# Altium schematic sheet E-06 CPU IO_PHY.SchDoc: FRDM-IMX93
size 513 x 386 mm; DrawnBy: FORLINX; Organization: ORGANIZATION; Address1: ADDRESS 1; Address2: ADDRESS 2; Address3: ADDRESS 3; Address4: ADDRESS 4; Revision: -; ENG_APP_DATE: --/--/--; DSN_APP_DATE: --/--/--; CHK_APP_DATE: --/--/--; Classification: Public, Company Internal/Proprietary, Company Confidential,  Company Secret; Page Create Date: March  8, 1995; OrgName: NXP Semiconductor; FIUO: A; OrgAddr1: NO. 192 Liangjing Rd. Pudong New Area, ShangHai; Page Number: 6; PageTitle: CPU IO/PHY; Page Size: C; Page Count: 23; Designer: FORLINX; RevCode: B1; Approver: NXP SE; Doc: SCH-94611 PDF: SPF-94611; DsnPath: T:\FILES\Designs\Single Board Computers\i.MX93-FRDM\Design Files\SCH-94611_B1.DSN; SchematicName: FRDM-i.MX 93 Development Board; PageName: E-06 CPU IO/PHY; PageSize: C; TopSchematic: True
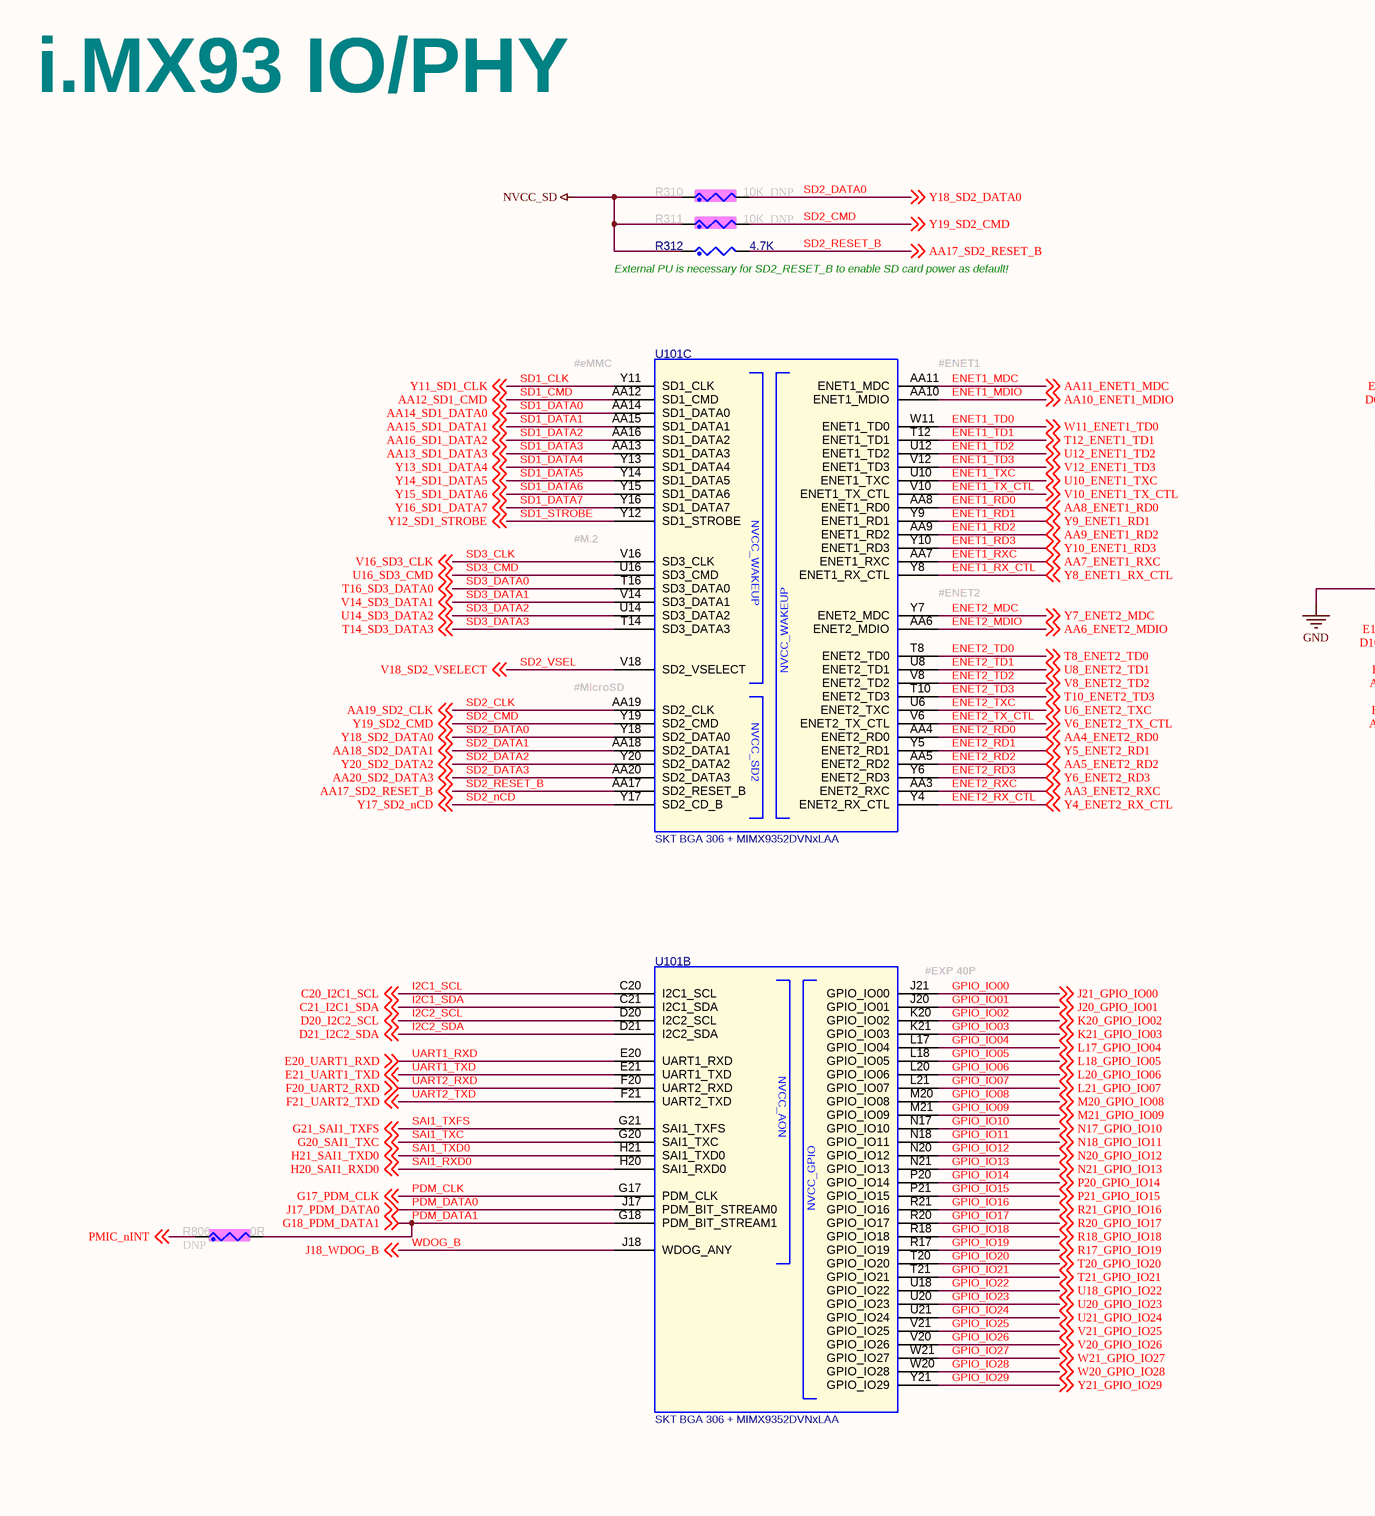
[diagram p0: E-06 CPU IO_PHY.SchDoc, left]
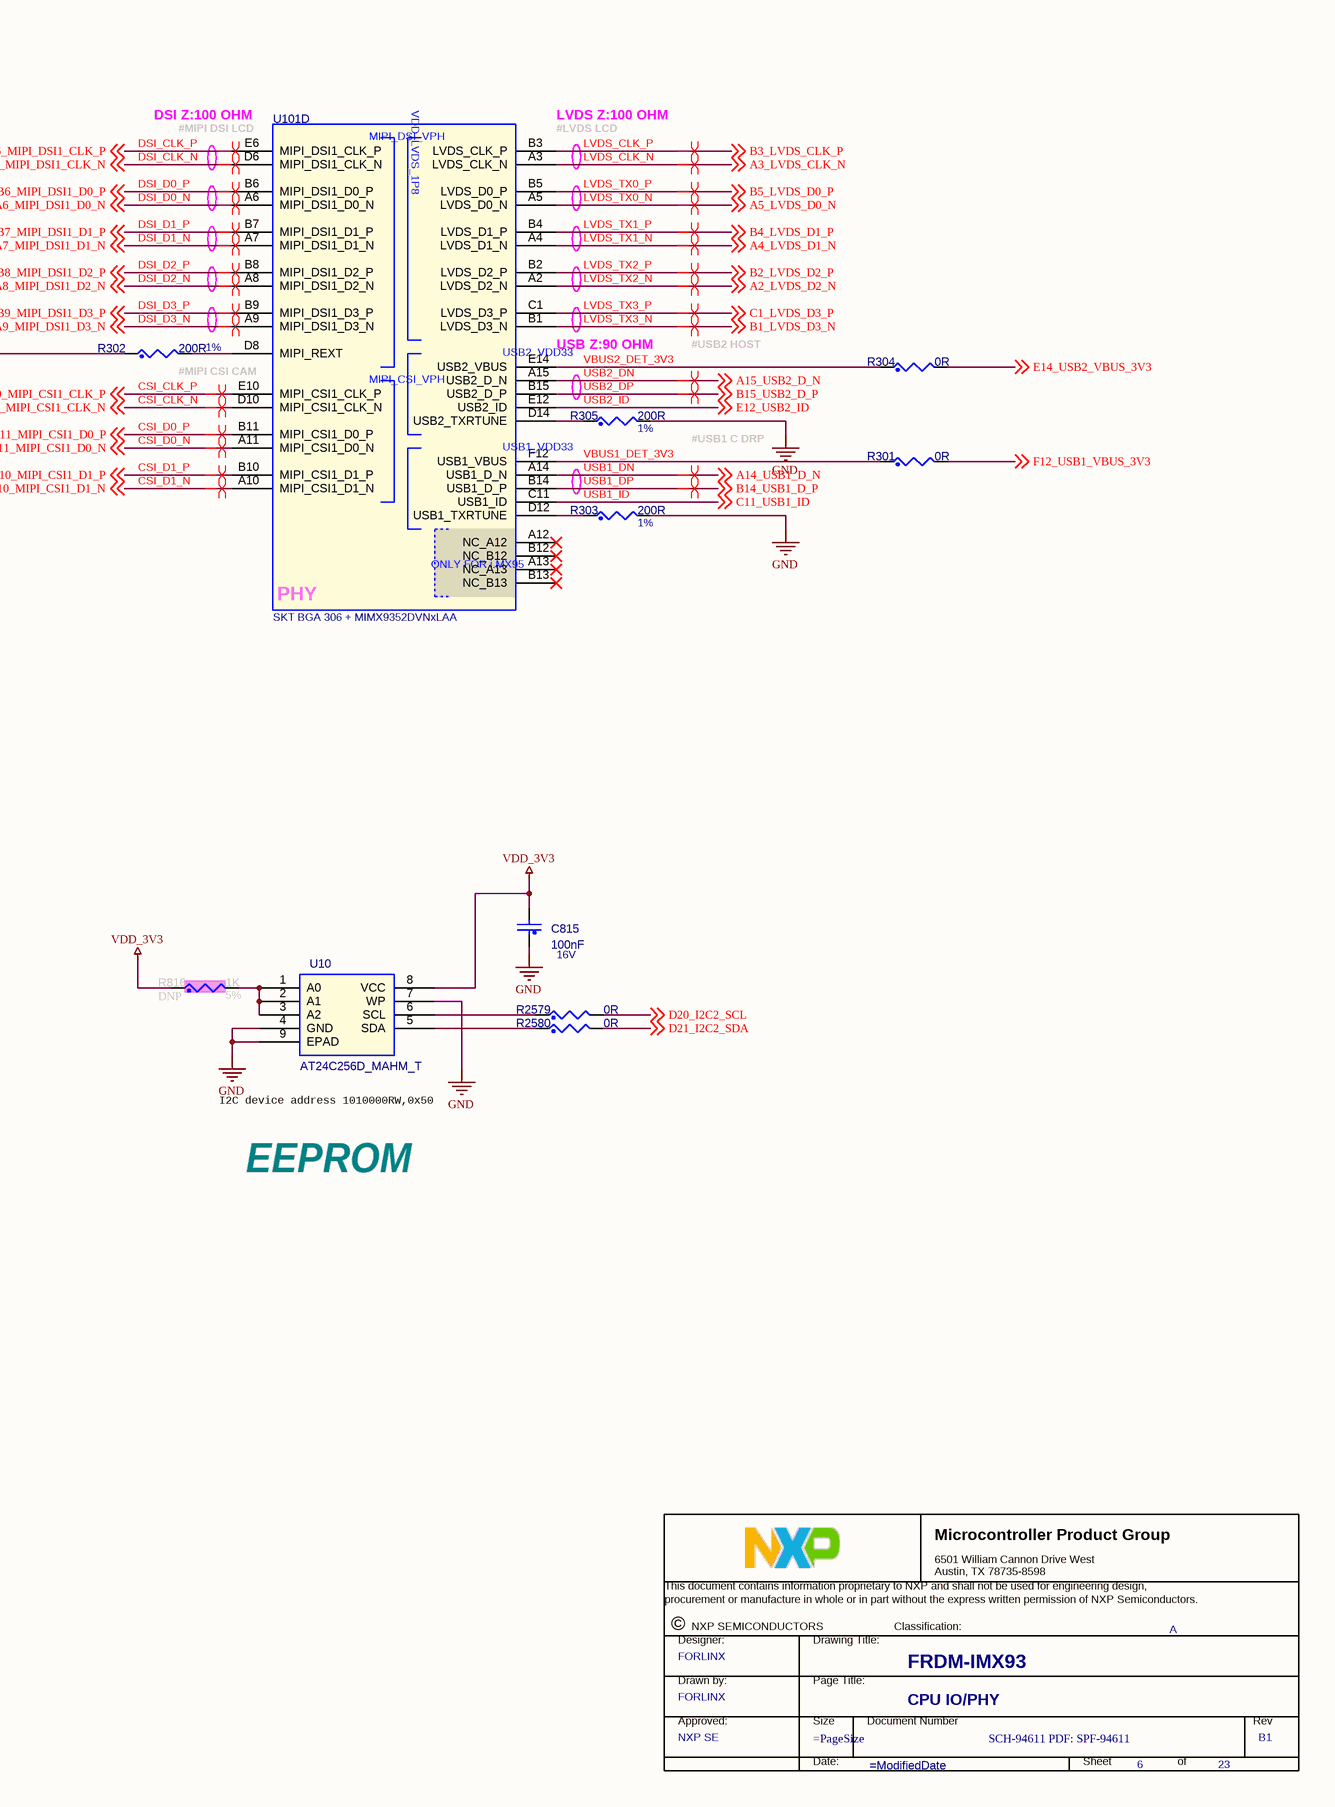
[diagram p1: E-06 CPU IO_PHY.SchDoc, right]

## Parts
*  Title: FRDM-IMX93  RevCode: B1  PageTitle: CPU IO/PHY  Page Number: 6  Page Count: 23  DrawnBy: FORLINX  Doc: SCH-94611 PDF: SPF-94611  Approver: NXP SE  FIUO: A  (graphical)
C815  100nF  VOLTAGE: 16V  [C0402]
R301  0R  [R0201]
R302  200R  Tolerance: 1%  [R0201]
R303  200R  Tolerance: 1%  [R0201]
R304  0R  [R0201]
R305  200R  Tolerance: 1%  [R0201]
R310  10K  ASSY_OPT: DNP  [R0402]
R311  10K  ASSY_OPT: DNP  [R0402]
R312  4.7K  [R0402]
R806  0R  ASSY_OPT: DNP  [R0201]
R816  1K  ASSY_OPT: DNP  Tolerance: 5%  [R0402]
R2579  0R  [R0402]
R2580  0R  [R0402]
U10  AT24C256D_MAHM_T  [UDFN-8P]
U101  SKT BGA 306 + MIMX9352DVNxLAA  [skt_bga306_0p5_sq16p23_elast_nsp]  (parts B,C,D of 6)

## Nets
GND: C815.1 R302.1 R303.2 R305.2 U10.4(GND) U10.7(WP) U10.9(EPAD)
NVCC_SD: R310.1 R311.1 R312.1
VDD_3V3: C815.2 R816.1 U10.8(VCC)
CSI_CLK_N: U101.D10(MIPI_CSI1_CLK_N) ; off-sheet D10_MIPI_CSI1_CLK_N  [also labelled D10_MIPI_CSI1_CLK_N]
CSI_CLK_P: U101.E10(MIPI_CSI1_CLK_P) ; off-sheet E10_MIPI_CSI1_CLK_P  [also labelled E10_MIPI_CSI1_CLK_P]
CSI_D0_N: U101.A11(MIPI_CSI1_D0_N) ; off-sheet A11_MIPI_CSI1_D0_N  [also labelled A11_MIPI_CSI1_D0_N]
CSI_D0_P: U101.B11(MIPI_CSI1_D0_P) ; off-sheet B11_MIPI_CSI1_D0_P  [also labelled B11_MIPI_CSI1_D0_P]
CSI_D1_N: U101.A10(MIPI_CSI1_D1_N) ; off-sheet A10_MIPI_CSI1_D1_N  [also labelled A10_MIPI_CSI1_D1_N]
CSI_D1_P: U101.B10(MIPI_CSI1_D1_P) ; off-sheet B10_MIPI_CSI1_D1_P  [also labelled B10_MIPI_CSI1_D1_P]
DSI_CLK_N: U101.D6(MIPI_DSI1_CLK_N) ; off-sheet D6_MIPI_DSI1_CLK_N  [also labelled D6_MIPI_DSI1_CLK_N]
DSI_CLK_P: U101.E6(MIPI_DSI1_CLK_P) ; off-sheet E6_MIPI_DSI1_CLK_P  [also labelled E6_MIPI_DSI1_CLK_P]
DSI_D0_N: U101.A6(MIPI_DSI1_D0_N) ; off-sheet A6_MIPI_DSI1_D0_N  [also labelled A6_MIPI_DSI1_D0_N]
DSI_D0_P: U101.B6(MIPI_DSI1_D0_P) ; off-sheet B6_MIPI_DSI1_D0_P  [also labelled B6_MIPI_DSI1_D0_P]
DSI_D1_N: U101.A7(MIPI_DSI1_D1_N) ; off-sheet A7_MIPI_DSI1_D1_N  [also labelled A7_MIPI_DSI1_D1_N]
DSI_D1_P: U101.B7(MIPI_DSI1_D1_P) ; off-sheet B7_MIPI_DSI1_D1_P  [also labelled B7_MIPI_DSI1_D1_P]
DSI_D2_N: U101.A8(MIPI_DSI1_D2_N) ; off-sheet A8_MIPI_DSI1_D2_N  [also labelled A8_MIPI_DSI1_D2_N]
DSI_D2_P: U101.B8(MIPI_DSI1_D2_P) ; off-sheet B8_MIPI_DSI1_D2_P  [also labelled B8_MIPI_DSI1_D2_P]
DSI_D3_N: U101.A9(MIPI_DSI1_D3_N) ; off-sheet A9_MIPI_DSI1_D3_N  [also labelled A9_MIPI_DSI1_D3_N]
DSI_D3_P: U101.B9(MIPI_DSI1_D3_P) ; off-sheet B9_MIPI_DSI1_D3_P  [also labelled B9_MIPI_DSI1_D3_P]
E14_USB2_VBUS_3V3: R304.2 ; off-sheet E14_USB2_VBUS_3V3
ENET1_MDC: U101.AA11(ENET1_MDC) ; off-sheet AA11_ENET1_MDC  [also labelled AA11_ENET1_MDC]
ENET1_MDIO: U101.AA10(ENET1_MDIO) ; off-sheet AA10_ENET1_MDIO  [also labelled AA10_ENET1_MDIO]
ENET1_RD0: U101.AA8(ENET1_RD0) ; off-sheet AA8_ENET1_RD0  [also labelled AA8_ENET1_RD0]
ENET1_RD1: U101.Y9(ENET1_RD1) ; off-sheet Y9_ENET1_RD1  [also labelled Y9_ENET1_RD1]
ENET1_RD2: U101.AA9(ENET1_RD2) ; off-sheet AA9_ENET1_RD2  [also labelled AA9_ENET1_RD2]
ENET1_RD3: U101.Y10(ENET1_RD3) ; off-sheet Y10_ENET1_RD3  [also labelled Y10_ENET1_RD3]
ENET1_RX_CTL: U101.Y8(ENET1_RX_CTL) ; off-sheet Y8_ENET1_RX_CTL  [also labelled Y8_ENET1_RX_CTL]
ENET1_RXC: U101.AA7(ENET1_RXC) ; off-sheet AA7_ENET1_RXC  [also labelled AA7_ENET1_RXC]
ENET1_TD0: U101.W11(ENET1_TD0) ; off-sheet W11_ENET1_TD0  [also labelled W11_ENET1_TD0]
ENET1_TD1: U101.T12(ENET1_TD1) ; off-sheet T12_ENET1_TD1  [also labelled T12_ENET1_TD1]
ENET1_TD2: U101.U12(ENET1_TD2) ; off-sheet U12_ENET1_TD2  [also labelled U12_ENET1_TD2]
ENET1_TD3: U101.V12(ENET1_TD3) ; off-sheet V12_ENET1_TD3  [also labelled V12_ENET1_TD3]
ENET1_TX_CTL: U101.V10(ENET1_TX_CTL) ; off-sheet V10_ENET1_TX_CTL  [also labelled V10_ENET1_TX_CTL]
ENET1_TXC: U101.U10(ENET1_TXC) ; off-sheet U10_ENET1_TXC  [also labelled U10_ENET1_TXC]
ENET2_MDC: U101.Y7(ENET2_MDC) ; off-sheet Y7_ENET2_MDC  [also labelled Y7_ENET2_MDC]
ENET2_MDIO: U101.AA6(ENET2_MDIO) ; off-sheet AA6_ENET2_MDIO  [also labelled AA6_ENET2_MDIO]
ENET2_RD0: U101.AA4(ENET2_RD0) ; off-sheet AA4_ENET2_RD0  [also labelled AA4_ENET2_RD0]
ENET2_RD1: U101.Y5(ENET2_RD1) ; off-sheet Y5_ENET2_RD1  [also labelled Y5_ENET2_RD1]
ENET2_RD2: U101.AA5(ENET2_RD2) ; off-sheet AA5_ENET2_RD2  [also labelled AA5_ENET2_RD2]
ENET2_RD3: U101.Y6(ENET2_RD3) ; off-sheet Y6_ENET2_RD3  [also labelled Y6_ENET2_RD3]
ENET2_RX_CTL: U101.Y4(ENET2_RX_CTL) ; off-sheet Y4_ENET2_RX_CTL  [also labelled Y4_ENET2_RX_CTL]
ENET2_RXC: U101.AA3(ENET2_RXC) ; off-sheet AA3_ENET2_RXC  [also labelled AA3_ENET2_RXC]
ENET2_TD0: U101.T8(ENET2_TD0) ; off-sheet T8_ENET2_TD0  [also labelled T8_ENET2_TD0]
ENET2_TD1: U101.U8(ENET2_TD1) ; off-sheet U8_ENET2_TD1  [also labelled U8_ENET2_TD1]
ENET2_TD2: U101.V8(ENET2_TD2) ; off-sheet V8_ENET2_TD2  [also labelled V8_ENET2_TD2]
ENET2_TD3: U101.T10(ENET2_TD3) ; off-sheet T10_ENET2_TD3  [also labelled T10_ENET2_TD3]
ENET2_TX_CTL: U101.V6(ENET2_TX_CTL) ; off-sheet V6_ENET2_TX_CTL  [also labelled V6_ENET2_TX_CTL]
ENET2_TXC: U101.U6(ENET2_TXC) ; off-sheet U6_ENET2_TXC  [also labelled U6_ENET2_TXC]
F12_USB1_VBUS_3V3: R301.2 ; off-sheet F12_USB1_VBUS_3V3
GPIO_IO00: U101.J21(GPIO_IO00) ; off-sheet J21_GPIO_IO00  [also labelled J21_GPIO_IO00]
GPIO_IO01: U101.J20(GPIO_IO01) ; off-sheet J20_GPIO_IO01  [also labelled J20_GPIO_IO01]
GPIO_IO02: U101.K20(GPIO_IO02) ; off-sheet K20_GPIO_IO02  [also labelled K20_GPIO_IO02]
GPIO_IO03: U101.K21(GPIO_IO03) ; off-sheet K21_GPIO_IO03  [also labelled K21_GPIO_IO03]
GPIO_IO04: U101.L17(GPIO_IO04) ; off-sheet L17_GPIO_IO04  [also labelled L17_GPIO_IO04]
GPIO_IO05: U101.L18(GPIO_IO05) ; off-sheet L18_GPIO_IO05  [also labelled L18_GPIO_IO05]
GPIO_IO06: U101.L20(GPIO_IO06) ; off-sheet L20_GPIO_IO06  [also labelled L20_GPIO_IO06]
GPIO_IO07: U101.L21(GPIO_IO07) ; off-sheet L21_GPIO_IO07  [also labelled L21_GPIO_IO07]
GPIO_IO08: U101.M20(GPIO_IO08) ; off-sheet M20_GPIO_IO08  [also labelled M20_GPIO_IO08]
GPIO_IO09: U101.M21(GPIO_IO09) ; off-sheet M21_GPIO_IO09  [also labelled M21_GPIO_IO09]
GPIO_IO10: U101.N17(GPIO_IO10) ; off-sheet N17_GPIO_IO10  [also labelled N17_GPIO_IO10]
GPIO_IO11: U101.N18(GPIO_IO11) ; off-sheet N18_GPIO_IO11  [also labelled N18_GPIO_IO11]
GPIO_IO12: U101.N20(GPIO_IO12) ; off-sheet N20_GPIO_IO12  [also labelled N20_GPIO_IO12]
GPIO_IO13: U101.N21(GPIO_IO13) ; off-sheet N21_GPIO_IO13  [also labelled N21_GPIO_IO13]
GPIO_IO14: U101.P20(GPIO_IO14) ; off-sheet P20_GPIO_IO14  [also labelled P20_GPIO_IO14]
GPIO_IO15: U101.P21(GPIO_IO15) ; off-sheet P21_GPIO_IO15  [also labelled P21_GPIO_IO15]
GPIO_IO16: U101.R21(GPIO_IO16) ; off-sheet R21_GPIO_IO16  [also labelled R21_GPIO_IO16]
GPIO_IO17: U101.R20(GPIO_IO17) ; off-sheet R20_GPIO_IO17  [also labelled R20_GPIO_IO17]
GPIO_IO18: U101.R18(GPIO_IO18) ; off-sheet R18_GPIO_IO18  [also labelled R18_GPIO_IO18]
GPIO_IO19: U101.R17(GPIO_IO19) ; off-sheet R17_GPIO_IO19  [also labelled R17_GPIO_IO19]
GPIO_IO20: U101.T20(GPIO_IO20) ; off-sheet T20_GPIO_IO20  [also labelled T20_GPIO_IO20]
GPIO_IO21: U101.T21(GPIO_IO21) ; off-sheet T21_GPIO_IO21  [also labelled T21_GPIO_IO21]
GPIO_IO22: U101.U18(GPIO_IO22) ; off-sheet U18_GPIO_IO22  [also labelled U18_GPIO_IO22]
GPIO_IO23: U101.U20(GPIO_IO23) ; off-sheet U20_GPIO_IO23  [also labelled U20_GPIO_IO23]
GPIO_IO24: U101.U21(GPIO_IO24) ; off-sheet U21_GPIO_IO24  [also labelled U21_GPIO_IO24]
GPIO_IO25: U101.V21(GPIO_IO25) ; off-sheet V21_GPIO_IO25  [also labelled V21_GPIO_IO25]
GPIO_IO26: U101.V20(GPIO_IO26) ; off-sheet V20_GPIO_IO26  [also labelled V20_GPIO_IO26]
GPIO_IO27: U101.W21(GPIO_IO27) ; off-sheet W21_GPIO_IO27  [also labelled W21_GPIO_IO27]
GPIO_IO28: U101.W20(GPIO_IO28) ; off-sheet W20_GPIO_IO28  [also labelled W20_GPIO_IO28]
GPIO_IO29: U101.Y21(GPIO_IO29) ; off-sheet Y21_GPIO_IO29  [also labelled Y21_GPIO_IO29]
I2C1_SCL: U101.C20(I2C1_SCL) ; off-sheet C20_I2C1_SCL  [also labelled C20_I2C1_SCL]
I2C1_SDA: U101.C21(I2C1_SDA) ; off-sheet C21_I2C1_SDA  [also labelled C21_I2C1_SDA]
I2C2_SCL: R2579.2 U101.D20(I2C2_SCL) ; off-sheet D20_I2C2_SCL  [also labelled D20_I2C2_SCL]
I2C2_SDA: R2580.2 U101.D21(I2C2_SDA) ; off-sheet D21_I2C2_SDA  [also labelled D21_I2C2_SDA]
LVDS_CLK_N: U101.A3(LVDS_CLK_N) ; off-sheet A3_LVDS_CLK_N  [also labelled A3_LVDS_CLK_N]
LVDS_CLK_P: U101.B3(LVDS_CLK_P) ; off-sheet B3_LVDS_CLK_P  [also labelled B3_LVDS_CLK_P]
LVDS_TX0_N: U101.A5(LVDS_D0_N) ; off-sheet A5_LVDS_D0_N  [also labelled A5_LVDS_D0_N]
LVDS_TX0_P: U101.B5(LVDS_D0_P) ; off-sheet B5_LVDS_D0_P  [also labelled B5_LVDS_D0_P]
LVDS_TX1_N: U101.A4(LVDS_D1_N) ; off-sheet A4_LVDS_D1_N  [also labelled A4_LVDS_D1_N]
LVDS_TX1_P: U101.B4(LVDS_D1_P) ; off-sheet B4_LVDS_D1_P  [also labelled B4_LVDS_D1_P]
LVDS_TX2_N: U101.A2(LVDS_D2_N) ; off-sheet A2_LVDS_D2_N  [also labelled A2_LVDS_D2_N]
LVDS_TX2_P: U101.B2(LVDS_D2_P) ; off-sheet B2_LVDS_D2_P  [also labelled B2_LVDS_D2_P]
LVDS_TX3_N: U101.B1(LVDS_D3_N) ; off-sheet B1_LVDS_D3_N  [also labelled B1_LVDS_D3_N]
LVDS_TX3_P: U101.C1(LVDS_D3_P) ; off-sheet C1_LVDS_D3_P  [also labelled C1_LVDS_D3_P]
PDM_CLK: U101.G17(PDM_CLK) ; off-sheet G17_PDM_CLK  [also labelled G17_PDM_CLK]
PDM_DATA0: U101.J17(PDM_BIT_STREAM0) ; off-sheet J17_PDM_DATA0  [also labelled J17_PDM_DATA0]
PDM_DATA1: R806.2 U101.G18(PDM_BIT_STREAM1) ; off-sheet G18_PDM_DATA1  [also labelled G18_PDM_DATA1]
PMIC_nINT: R806.1 ; off-sheet PMIC_nINT
SAI1_RXD0: U101.H20(SAI1_RXD0) ; off-sheet H20_SAI1_RXD0  [also labelled H20_SAI1_RXD0]
SAI1_TXC: U101.G20(SAI1_TXC) ; off-sheet G20_SAI1_TXC  [also labelled G20_SAI1_TXC]
SAI1_TXD0: U101.H21(SAI1_TXD0) ; off-sheet H21_SAI1_TXD0  [also labelled H21_SAI1_TXD0]
SAI1_TXFS: U101.G21(SAI1_TXFS) ; off-sheet G21_SAI1_TXFS  [also labelled G21_SAI1_TXFS]
SD1_CLK: U101.Y11(SD1_CLK) ; off-sheet Y11_SD1_CLK  [also labelled Y11_SD1_CLK]
SD1_CMD: U101.AA12(SD1_CMD) ; off-sheet AA12_SD1_CMD  [also labelled AA12_SD1_CMD]
SD1_DATA0: U101.AA14(SD1_DATA0) ; off-sheet AA14_SD1_DATA0  [also labelled AA14_SD1_DATA0]
SD1_DATA1: U101.AA15(SD1_DATA1) ; off-sheet AA15_SD1_DATA1  [also labelled AA15_SD1_DATA1]
SD1_DATA2: U101.AA16(SD1_DATA2) ; off-sheet AA16_SD1_DATA2  [also labelled AA16_SD1_DATA2]
SD1_DATA3: U101.AA13(SD1_DATA3) ; off-sheet AA13_SD1_DATA3  [also labelled AA13_SD1_DATA3]
SD1_DATA4: U101.Y13(SD1_DATA4) ; off-sheet Y13_SD1_DATA4  [also labelled Y13_SD1_DATA4]
SD1_DATA5: U101.Y14(SD1_DATA5) ; off-sheet Y14_SD1_DATA5  [also labelled Y14_SD1_DATA5]
SD1_DATA6: U101.Y15(SD1_DATA6) ; off-sheet Y15_SD1_DATA6  [also labelled Y15_SD1_DATA6]
SD1_DATA7: U101.Y16(SD1_DATA7) ; off-sheet Y16_SD1_DATA7  [also labelled Y16_SD1_DATA7]
SD1_STROBE: U101.Y12(SD1_STROBE) ; off-sheet Y12_SD1_STROBE  [also labelled Y12_SD1_STROBE]
SD2_CLK: U101.AA19(SD2_CLK) ; off-sheet AA19_SD2_CLK  [also labelled AA19_SD2_CLK]
SD2_CMD: R311.2 U101.Y19(SD2_CMD) ; off-sheet Y19_SD2_CMD  [also labelled Y19_SD2_CMD]
SD2_DATA0: R310.2 U101.Y18(SD2_DATA0) ; off-sheet Y18_SD2_DATA0  [also labelled Y18_SD2_DATA0]
SD2_DATA1: U101.AA18(SD2_DATA1) ; off-sheet AA18_SD2_DATA1  [also labelled AA18_SD2_DATA1]
SD2_DATA2: U101.Y20(SD2_DATA2) ; off-sheet Y20_SD2_DATA2  [also labelled Y20_SD2_DATA2]
SD2_DATA3: U101.AA20(SD2_DATA3) ; off-sheet AA20_SD2_DATA3  [also labelled AA20_SD2_DATA3]
SD2_nCD: U101.Y17(SD2_CD_B) ; off-sheet Y17_SD2_nCD  [also labelled Y17_SD2_nCD]
SD2_RESET_B: R312.2 U101.AA17(SD2_RESET_B) ; off-sheet AA17_SD2_RESET_B  [also labelled AA17_SD2_RESET_B]
SD2_VSEL: U101.V18(SD2_VSELECT) ; off-sheet V18_SD2_VSELECT  [also labelled V18_SD2_VSELECT]
SD3_CLK: U101.V16(SD3_CLK) ; off-sheet V16_SD3_CLK  [also labelled V16_SD3_CLK]
SD3_CMD: U101.U16(SD3_CMD) ; off-sheet U16_SD3_CMD  [also labelled U16_SD3_CMD]
SD3_DATA0: U101.T16(SD3_DATA0) ; off-sheet T16_SD3_DATA0  [also labelled T16_SD3_DATA0]
SD3_DATA1: U101.V14(SD3_DATA1) ; off-sheet V14_SD3_DATA1  [also labelled V14_SD3_DATA1]
SD3_DATA2: U101.U14(SD3_DATA2) ; off-sheet U14_SD3_DATA2  [also labelled U14_SD3_DATA2]
SD3_DATA3: U101.T14(SD3_DATA3) ; off-sheet T14_SD3_DATA3  [also labelled T14_SD3_DATA3]
UART1_RXD: U101.E20(UART1_RXD) ; off-sheet E20_UART1_RXD  [also labelled E20_UART1_RXD]
UART1_TXD: U101.E21(UART1_TXD) ; off-sheet E21_UART1_TXD  [also labelled E21_UART1_TXD]
UART2_RXD: U101.F20(UART2_RXD) ; off-sheet F20_UART2_RXD  [also labelled F20_UART2_RXD]
UART2_TXD: U101.F21(UART2_TXD) ; off-sheet F21_UART2_TXD  [also labelled F21_UART2_TXD]
USB1_DN: U101.A14(USB1_D_N) ; off-sheet A14_USB1_D_N  [also labelled A14_USB1_D_N]
USB1_DP: U101.B14(USB1_D_P) ; off-sheet B14_USB1_D_P  [also labelled B14_USB1_D_P]
USB1_ID: U101.C11(USB1_ID) ; off-sheet C11_USB1_ID  [also labelled C11_USB1_ID]
USB2_DN: U101.A15(USB2_D_N) ; off-sheet A15_USB2_D_N  [also labelled A15_USB2_D_N]
USB2_DP: U101.B15(USB2_D_P) ; off-sheet B15_USB2_D_P  [also labelled B15_USB2_D_P]
USB2_ID: U101.E12(USB2_ID) ; off-sheet E12_USB2_ID  [also labelled E12_USB2_ID]
VBUS1_DET_3V3: R301.1 U101.F12(USB1_VBUS)
VBUS2_DET_3V3: R304.1 U101.E14(USB2_VBUS)
WDOG_B: U101.J18(WDOG_ANY) ; off-sheet J18_WDOG_B  [also labelled J18_WDOG_B]
NetR302_2: R302.2 U101.D8(MIPI_REXT)
NetR303_1: R303.1 U101.D12(USB1_TXRTUNE)
NetR305_1: R305.1 U101.D14(USB2_TXRTUNE)
NetR816_2: R816.2 U10.1(A0) U10.2(A1) U10.3(A2)
NetR2579_1: R2579.1 U10.6(SCL)
NetR2580_1: R2580.1 U10.5(SDA)

Not connected (* = marked no-connect by the designer): U101 A12(NC_A12)* A13(NC_A13)* B12(NC_B12)* B13(NC_B13)*

## Layout directives
differential pair: CSI_CLK_N, CSI_CLK_P, CSI_D0_N, CSI_D0_P, CSI_D1_N, CSI_D1_P, DSI_CLK_N, DSI_CLK_P, DSI_D0_N, DSI_D0_P, DSI_D1_N, DSI_D1_P, DSI_D2_N, DSI_D2_P, DSI_D3_N, DSI_D3_P, LVDS_CLK_N, LVDS_CLK_P, LVDS_TX0_N, LVDS_TX0_P, LVDS_TX1_N, LVDS_TX1_P, LVDS_TX2_N, LVDS_TX2_P, LVDS_TX3_N, LVDS_TX3_P, USB1_DN, USB1_DP, USB2_DN, USB2_DP

## Notes on the sheet
- i.MX93 IO/PHY
- (near R312) External PU is necessary for SD2_RESET_B to enable SD card power as default!
- (near U101) DSI Z:100 OHM
- (near U101) LVDS Z:100 OHM
- #eMMC
- (near U101) #ENET1
- (near U101) #MIPI DSI LCD
- (near U101) #LVDS LCD
- #M.2
- (near U101) #ENET2
- #MIPI CSI CAM
- (near U101) USB Z:90 OHM
- #USB2 HOST
- (near U101) #MicroSD
- #USB1 C DRP
- (near U101) PHY
- (near U101) #EXP 40P
- I2C device address 1010000RW,0x50
- EEPROM
- DWG. NO.
- REV.
- SHT.
- REVISION
- DESCRIPTION
- DATE
- APPROVED
- ENG:
- APPROVALS
- quilter.ai <http://quilter.ai>
- DSN:
- CHK:
- REFERENCE DOCUMENTS
- TITLE
- PROJECT
- BOM:
- FAB DWG:
- PCB DWG:
- ASSY DWG:
- SIZE
- FILE NAME
- C
- DWG NO.
- SHEET
- OF
- REV
- (in symbol MIMX9352DVNxLAA, part B) NVCC_GPIO
- (in symbol MIMX9352DVNxLAA, part C) NVCC_WAKEUP
- (in symbol MIMX9352DVNxLAA, part D) MIPI_DSI_VPH; USB2_VDD33; MIPI_CSI_VPH; USB1_VDD33; ONLY FOR i.MX95
- (in symbol TitleBlock_MCPG) Microcontroller Product Group; 6501 William Cannon Drive West / Austin, TX 78735-8598; This document contains information proprietary to NXP and shall not be used for engineering design,; procurement or manufacture in whole or in part without the express written permission of NXP Semiconductors.; ©; NXP SEMICONDUCTORS; Classification:; Designer:; Drawing Title:; Drawn by:; Page Title:; Approved:; Size; Document Number; Rev; Date:; Sheet; of

## Library data of the parts
* = TitleBlock_MCPG: Classification: Public, Company Internal/Proprietary, Company Confidential,  Company Secret; OrgName: NXP Semiconductor; OrgAddr1: NO. 192 Liangjing Rd. Pudong New Area, ShangHai; Page Size: =PageSize; Page Create Date: March  8, 1995; Designer: FORLINX; Page Modify Date: =ModifiedDate
C815 = CAP_NP: 0402,100nF,50V,+/-10%,X5R; Part Reference: C815; CLASS: DISCRETE; MFG_PN01: 0402X104K500NT; MFG_NAME01: FENGHUA; CAD_APPROVED: Yes; Tolerance: 10%; FPLIST: CC0402_25,CC0402_HD,0402_CC,capc0402_l; Value: 100nF; ROHS: Yes; HEIGHT: 0.55 MM; PCB Footprint: C0402
R301 = RES: 0201,0Ohm,+/-5%; Part Reference: R301; CLASS: DISCRETE; FPLIST: RC0201,0201_CC,RC0201_X2; CAD_APPROVED: Yes; MFG_PN01: RC-01000JT; MFG_NAME01: FENGHUA; Value: 0R; HEIGHT: 0.30 MM; ROHS: Yes; PCB Footprint: R0201
R302 = RES: 0201,200Ohm,+/-1%; Part Reference: R302; CLASS: DISCRETE; Temp Range: -55¡ãC ~ 125¡ãC; VOLTAGE: 25V; MFG_NAME01: FENGHUA; MFG_PN01: RC-01W2000FT; CAD_APPROVED: Yes; FPLIST: RC0201,0201_CC; Value: 200R; ROHS: Yes; Temp_Range: -55¡ãC ~ 125¡ãC; HEIGHT: 0.26MM; PCB Footprint: R0201
R303 = RES: 0201,200Ohm,+/-1%; Part Reference: R303; CLASS: DISCRETE; FPLIST: RC0201,0201_CC; CAD_APPROVED: Yes; Temp_Range: -55¡ãC ~ 125¡ãC; MFG_PN01: RC-01W2000FT; MFG_NAME01: FENGHUA; VOLTAGE: 25V; Value: 200R; HEIGHT: 0.26MM; ROHS: Yes; Temp Range: -55¡ãC ~ 125¡ãC; PCB Footprint: R0201
R304 = RES: 0201,0Ohm,+/-5%; Part Reference: R304; CLASS: DISCRETE; MFG_NAME01: FENGHUA; MFG_PN01: RC-01000JT; CAD_APPROVED: Yes; FPLIST: RC0201,0201_CC,RC0201_X2; Value: 0R; ROHS: Yes; HEIGHT: 0.30 MM; PCB Footprint: R0201
R305 = RES: 0201,200Ohm,+/-1%; Part Reference: R305; CLASS: DISCRETE; FPLIST: RC0201,0201_CC; CAD_APPROVED: Yes; Temp_Range: -55¡ãC ~ 125¡ãC; MFG_PN01: RC-01W2000FT; MFG_NAME01: FENGHUA; VOLTAGE: 25V; Value: 200R; HEIGHT: 0.26MM; ROHS: Yes; Temp Range: -55¡ãC ~ 125¡ãC; PCB Footprint: R0201
R310 = RES: 0402,10K,+/-1%; Part Reference: R310; CLASS: DISCRETE; FPLIST: RC0402_25,RC0402_HD,0402_CC; CAD_APPROVED: Yes; MFG_PN01: RC-02W1002FT; MFG_NAME01: FENGHUA; Tolerance: 5%; Value: 10K; HEIGHT: 0.4 MM; ROHS: Yes; PCB Footprint: R0402
R311 = RES: 0402,10K,+/-1%; Part Reference: R311; CLASS: DISCRETE; Tolerance: 5%; MFG_NAME01: FENGHUA; MFG_PN01: RC-02W1002FT; CAD_APPROVED: Yes; FPLIST: RC0402_25,RC0402_HD,0402_CC; Value: 10K; ROHS: Yes; HEIGHT: 0.4 MM; PCB Footprint: R0402
R312 = RES: 0402,4.7K,+/-1%; Part Reference: R312; CLASS: DISCRETE; Temp Range: -55C to +155C; Tolerance: 5%; MFG_NAME01: FENGHUA; MFG_PN01: RC-02K4701FT; CAD_APPROVED: Yes; FPLIST: RC0402_25,RC0402_HD,0402_CC,RC0402_X2; VOLTAGE: 50V; Value: 4.7K; ROHS: Yes; Temp_Range: -55C to +155C; HEIGHT: 0.41mm; PCB Footprint: R0402
R806 = RES: 0201,0Ohm,+/-5%; Part Reference: R806; CLASS: DISCRETE; MFG_NAME01: FENGHUA; MFG_PN01: RC-01000JT; CAD_APPROVED: Yes; FPLIST: RC0201,0201_CC,RC0201_X2; Value: 0R; ROHS: Yes; HEIGHT: 0.30 MM; PCB Footprint: R0201
R816 = RES: 0402,1K,+/-1%; Part Reference: R816; CLASS: DISCRETE; MFG_NAME01: FENGHUA; MFG_PN01: RC-02K1001FT; CAD_APPROVED: Yes; FPLIST: RC0402_25,RC0402_HD,0402_CC; Value: 1K; ROHS: Yes; HEIGHT: 0.4 MM; PCB Footprint: R0402
R2579 = RES: 0402,0Ohm,+/-1%; Part Reference: R2579; CLASS: DISCRETE; VOLTAGE: 1/16W; FPLIST: RC0402_25,RC0402_HD,RC0402_X2,0402_CC; CAD_APPROVED: Yes; MFG_PN01: RC-02000FT; MFG_NAME01: FENGHUA; Tolerance: 5%; Value: 0R; HEIGHT: 0.45 MM; ROHS: Yes; PCB Footprint: R0402
R2580 = RES: 0402,0Ohm,+/-1%; Part Reference: R2580; CLASS: DISCRETE; Tolerance: 5%; MFG_NAME01: FENGHUA; MFG_PN01: RC-02000FT; CAD_APPROVED: Yes; FPLIST: RC0402_25,RC0402_HD,RC0402_X2,0402_CC; VOLTAGE: 1/16W; Value: 0R; ROHS: Yes; HEIGHT: 0.45 MM; PCB Footprint: R0402
U10 = AT24C64D-MA9M_0: FT24C256A-ENR-T,UDFN8; Part Reference: U10; MFG_NAME01: ONSEMI; Value: AT24C256D_MAHM_T; MFG_PN01: FT24C256A-ENR-T; PCB Footprint: UDFN-8P
U101 = MIMX9352DVNxLAA: MIMX9352CVVXMAB,-40~105+C,11*11mm,0.5mm pitch,FCBGA,A,306pin,1.7GHz; Part Reference: U101; CLASS: IC; MFG_NAME01: NXP SEMICONDUCTORS; CAD_APPROVED: Yes; FPLIST: skt_bga306_0p5_sq16p23_elast,skt_bga306_0p5_sq16p23_elast_nsp; Value: SKT BGA 306 + MIMX9352DVNxLAA; MFG_PN01: MIMX9352DVNxLAA; ROHS: Yes; HEIGHT: 10.03MM; PCB Footprint: skt_bga306_0p5_sq16p23_elast_nsp